# EAGLE schematic technologies (EAGLE 6.6.0)
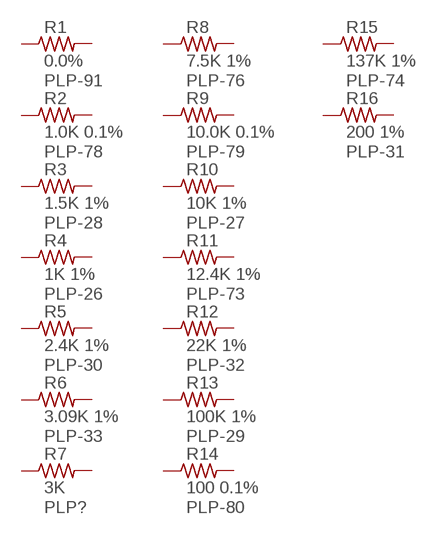
[diagram p0: schematic, sheet 1]

## Parts
R1  0.0%  RES-6030.0OHM  [DISCRETE_R0603]
R2  1.0K 0.1%  RES-6031.0K0.1%  [DISCRETE_R0603]
R3  1.5K 1%  RES-6031.5K1%  [DISCRETE_R0603]
R4  1K 1%  RES-6031K1%  [DISCRETE_R0603]
R5  2.4K 1%  RES-6032.4K1%  [DISCRETE_R0603]
R6  3.09K 1%  RES-6033.09K1%  [DISCRETE_R0603]
R7  3K  RES-6033K5%  [DISCRETE_R0603]
R8  7.5K 1%  RES-6037.5K1%  [DISCRETE_R0603]
R9  10.0K 0.1%  RES-60310.0K0.1%  [DISCRETE_R0603]
R10  10K 1%  RES-60310K1%  [DISCRETE_R0603]
R11  12.4K 1%  RES-60312.4K1%  [DISCRETE_R0603]
R12  22K 1%  RES-60322K1%  [DISCRETE_R0603]
R13  100K 1%  RES-603100K1%  [DISCRETE_R0603]
R14  100 0.1%  RES-603100OHM0.1%  [DISCRETE_R0603]
R15  137K 1%  RES-603137K1%  [DISCRETE_R0603]
R16  200 1%  RES-603200OHM1%  [DISCRETE_R0603]
Unconnected: R1.1 R1.2 R2.1 R2.2 R3.1 R3.2 R4.1 R4.2 R5.1 R5.2 R6.1 R6.2 R7.1 R7.2 R8.1 R8.2 R9.1 R9.2 R10.1 R10.2 R11.1 R11.2 R12.1 R12.2 R13.1 R13.2 R14.1 R14.2 R15.1 R15.2 R16.1 R16.2

## Library data of the parts
R1 = PLP:RES-603; PLP#: PLP-91
R2 = PLP:RES-603; PLP#: PLP-78
R3 = PLP:RES-603; PLP#: PLP-28
R4 = PLP:RES-603; PLP#: PLP-26
R5 = PLP:RES-603; PLP#: PLP-30
R6 = PLP:RES-603; PLP#: PLP-33
R7 = PLP:RES-603; PLP#: PLP?
R8 = PLP:RES-603; PLP#: PLP-76
R9 = PLP:RES-603; PLP#: PLP-79
R10 = PLP:RES-603; PLP#: PLP-27
R11 = PLP:RES-603; PLP#: PLP-73
R12 = PLP:RES-603; PLP#: PLP-32
R13 = PLP:RES-603; PLP#: PLP-29
R14 = PLP:RES-603; PLP#: PLP-80
R15 = PLP:RES-603; PLP#: PLP-74
R16 = PLP:RES-603; PLP#: PLP-31